# EAGLE schematic Yale spring 2019 FRIDAY (EAGLE 9.4.0)
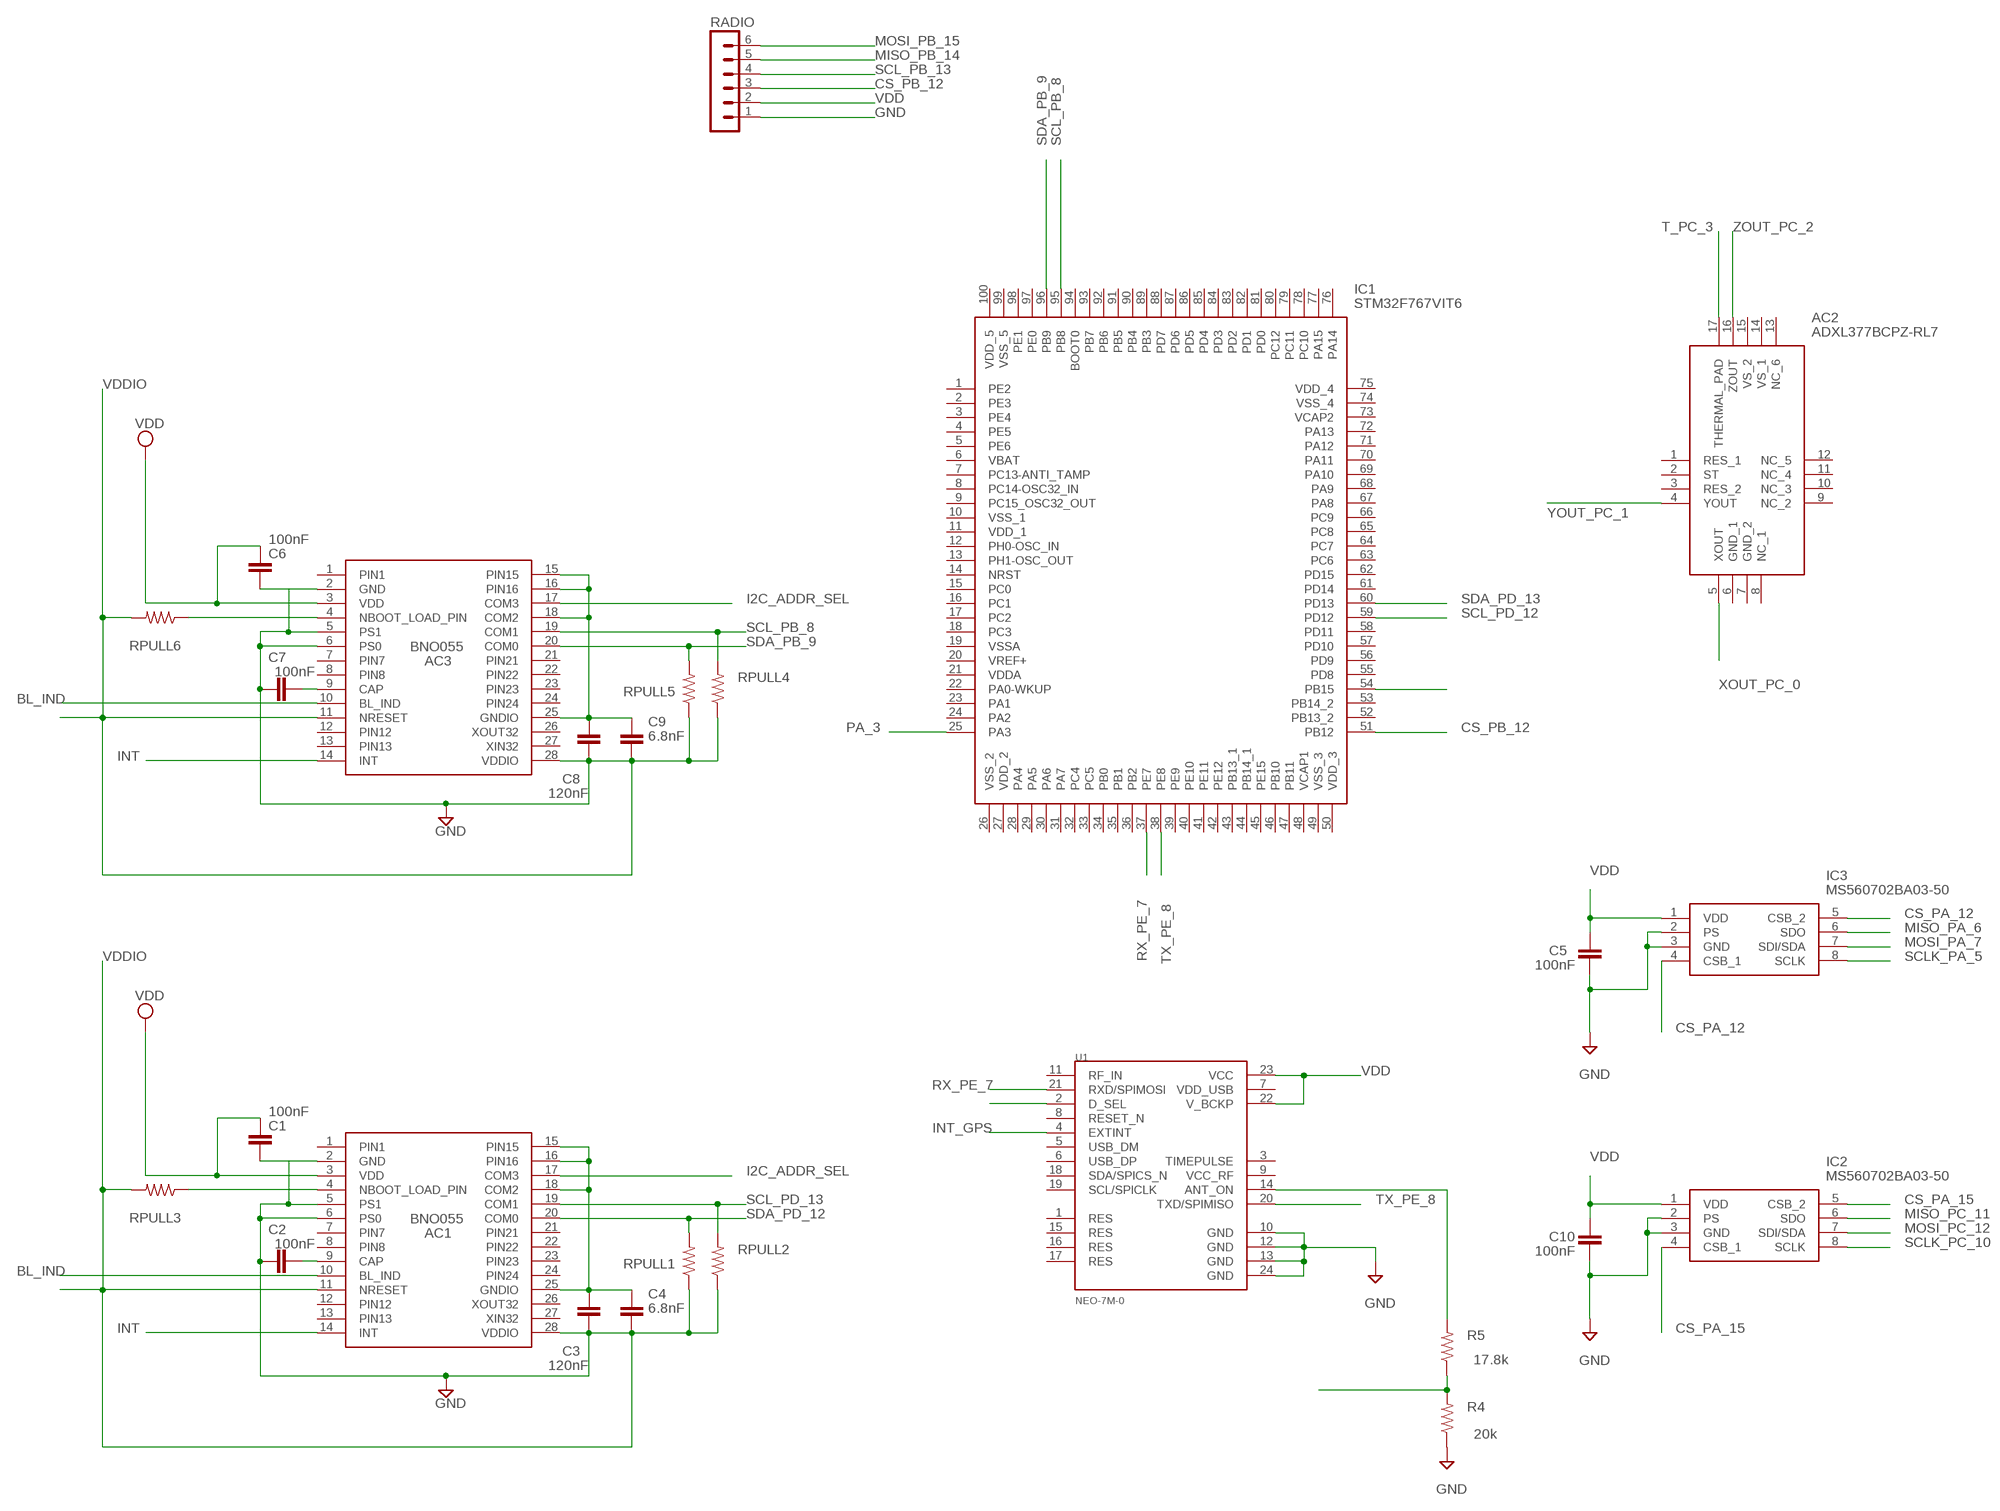
[diagram p0: schematic, sheet 1]

## Parts
AC1  BNO055  [BNO055]
AC2  ADXL377BCPZ-RL7  [QFN50P300X300X150-17N]
AC3  BNO055  [BNO055]
C1  100nF  C2,5-3  [C2.5-3]
C2  100nF  C2,5-3  [C2.5-3]
C3  120nF  C2,5-3  [C2.5-3]
C4  6.8nF  C2,5-3  [C2.5-3]
C5  100nF  C2,5-3  [C2.5-3]
C6  100nF  C2,5-3  [C2.5-3]
C7  100nF  C2,5-3  [C2.5-3]
C8  120nF  C2,5-3  [C2.5-3]
C9  6.8nF  C2,5-3  [C2.5-3]
C10  100nF  C2,5-3  [C2.5-3]
IC1  STM32F767VIT6  [QFP50P1600X1600X160-100N]
IC2  MS560702BA03-50  [MS5607-02BA03]
IC3  MS560702BA03-50  [MS5607-02BA03]
R4  20k  R-US_R0603  [R0603]
R5  17.8k  R-US_R0603  [R0603]
RADIO  MA06-1  [MA06-1]
RPULL1  R-US_R0603  [R0603]
RPULL2  R-US_R0603  [R0603]
RPULL3  R-US_R0603  [R0603]
RPULL4  R-US_R0603  [R0603]
RPULL5  R-US_R0603  [R0603]
RPULL6  R-US_R0603  [R0603]
U1  NEO-7M-0  [XCVR_NEO-7M-0]

## Nets
BL_IND: AC1.10(BL_IND) AC3.10(BL_IND)
CS_PA_12: IC3.4(CSB_1) IC3.5(CSB_2)
CS_PA_15: IC2.4(CSB_1) IC2.5(CSB_2)
CS_PB_12: IC1.51(PB12) RADIO.3
GND: C5.1 C10.1 IC2.2(PS) IC2.3(GND) IC3.2(PS) IC3.3(GND) R4.1 RADIO.1 U1.10(GND) U1.12(GND) U1.13(GND) U1.24(GND)
I2C_ADDR_SEL: AC1.17(COM3) AC3.17(COM3)
INT: AC1.14(INT) AC3.14(INT)
INT_GPS: U1.4(EXTINT)
MISO_PA_6: IC3.6(SDO)
MISO_PB_14: RADIO.5
MISO_PC_11: IC2.6(SDO)
MOSI_PA_7: IC3.7(SDI/SDA)
MOSI_PB_15: RADIO.6
MOSI_PC_12: IC2.7(SDI/SDA)
N$1: AC1.4(NBOOT_LOAD_PIN) RPULL3.1
N$2: AC1.15(PIN15) AC1.16(PIN16) AC1.18(COM2) AC1.25(GNDIO) C3.2 C4.2
N$3: AC3.9(CAP) C7.2
N$4: AC1.9(CAP) C2.2
N$5: AC3.15(PIN15) AC3.16(PIN16) AC3.18(COM2) AC3.25(GNDIO) C8.2 C9.2
N$6: AC3.4(NBOOT_LOAD_PIN) RPULL6.1
N$7: IC1.54(PB15)
N$9: U1.2(D_SEL)
N$10: R5.2 U1.14(ANT_ON)
N$11: R4.2 R5.1
PA_3: IC1.25(PA3)
RX_PE_7: IC1.37(PE7) U1.21(RXD/SPIMOSI)
SCL_PB_8: AC3.19(COM1) IC1.95(PB8) RPULL4.2
SCL_PB_13: RADIO.4
SCL_PD_12: IC1.59(PD12)
SCL_PD_13: AC1.19(COM1) RPULL2.2
SCLK_PA_5: IC3.8(SCLK)
SCLK_PC_10: IC2.8(SCLK)
SDA_PB_9: AC3.20(COM0) IC1.96(PB9) RPULL5.2
SDA_PD_12: AC1.20(COM0) RPULL1.2
SDA_PD_13: IC1.60(PD13)
T_PC_3: AC2.17(THERMAL_PAD)
TX_PE_8: IC1.38(PE8) U1.20(TXD/SPIMISO)
VDD: AC1.3(VDD) AC3.3(VDD) C1.1 C5.2 C6.1 C10.2 IC2.1(VDD) IC3.1(VDD) RADIO.2 U1.22(V_BCKP) U1.23(VCC)
VDDIO: AC1.2(GND) AC1.5(PS1) AC1.6(PS0) AC1.11(NRESET) AC1.28(VDDIO) AC3.2(GND) AC3.5(PS1) AC3.6(PS0) AC3.11(NRESET) AC3.28(VDDIO) C1.2 C2.1 C3.1 C4.1 C6.2 C7.1 C8.1 C9.1 RPULL1.1 RPULL2.1 RPULL3.2 RPULL4.1 RPULL5.1 RPULL6.2 ; supply symbol labelled GND
XOUT_PC_0: AC2.5(XOUT)
YOUT_PC_1: AC2.4(YOUT)
ZOUT_PC_2: AC2.16(ZOUT)
Unconnected: AC1.1(PIN1) AC1.7(PIN7) AC1.8(PIN8) AC1.12(PIN12) AC1.13(PIN13) AC1.21(PIN21) AC1.22(PIN22) AC1.23(PIN23) AC1.24(PIN24) AC1.26(XOUT32) AC1.27(XIN32) AC2.1(RES_1) AC2.2(ST) AC2.3(RES_2) AC2.6(GND_1) AC2.7(GND_2) AC2.8(NC_1) AC2.9(NC_2) AC2.10(NC_3) AC2.11(NC_4) AC2.12(NC_5) AC2.13(NC_6) AC2.14(VS_1) AC2.15(VS_2) AC3.1(PIN1) AC3.7(PIN7) AC3.8(PIN8) AC3.12(PIN12) AC3.13(PIN13) AC3.21(PIN21) AC3.22(PIN22) AC3.23(PIN23) AC3.24(PIN24) AC3.26(XOUT32) AC3.27(XIN32) IC1.1(PE2) IC1.2(PE3) IC1.3(PE4) IC1.4(PE5) IC1.5(PE6) IC1.6(VBAT) IC1.7(PC13-ANTI_TAMP) IC1.8(PC14-OSC32_IN) IC1.9(PC15_OSC32_OUT) IC1.10(VSS_1) IC1.11(VDD_1) IC1.12(PH0-OSC_IN) IC1.13(PH1-OSC_OUT) IC1.14(NRST) IC1.15(PC0) IC1.16(PC1) IC1.17(PC2) IC1.18(PC3) IC1.19(VSSA) IC1.20(VREF+) IC1.21(VDDA) IC1.22(PA0-WKUP) IC1.23(PA1) IC1.24(PA2) IC1.26(VSS_2) IC1.27(VDD_2) IC1.28(PA4) IC1.29(PA5) IC1.30(PA6) IC1.31(PA7) IC1.32(PC4) IC1.33(PC5) IC1.34(PB0) IC1.35(PB1) IC1.36(PB2) IC1.39(PE9) IC1.40(PE10) IC1.41(PE11) IC1.42(PE12) IC1.43(PB13_1) IC1.44(PB14_1) IC1.45(PE15) IC1.46(PB10) IC1.47(PB11) IC1.48(VCAP1) IC1.49(VSS_3) IC1.50(VDD_3) IC1.52(PB13_2) IC1.53(PB14_2) IC1.55(PD8) IC1.56(PD9) IC1.57(PD10) IC1.58(PD11) IC1.61(PD14) IC1.62(PD15) IC1.63(PC6) IC1.64(PC7) IC1.65(PC8) IC1.66(PC9) IC1.67(PA8) IC1.68(PA9) IC1.69(PA10) IC1.70(PA11) IC1.71(PA12) IC1.72(PA13) IC1.73(VCAP2) IC1.74(VSS_4) IC1.75(VDD_4) IC1.76(PA14) IC1.77(PA15) IC1.78(PC10) IC1.79(PC11) IC1.80(PC12) IC1.81(PD0) IC1.82(PD1) IC1.83(PD2) IC1.84(PD3) IC1.85(PD4) IC1.86(PD5) IC1.87(PD6) IC1.88(PD7) IC1.89(PB3) IC1.90(PB4) IC1.91(PB5) IC1.92(PB6) IC1.93(PB7) IC1.94(BOOT0) IC1.97(PE0) IC1.98(PE1) IC1.99(VSS_5) IC1.100(VDD_5) U1.1(RES) U1.3(TIMEPULSE) U1.5(USB_DM) U1.6(USB_DP) U1.8(RESET_N) U1.9(VCC_RF) U1.11(RF_IN) U1.15(RES) U1.16(RES) U1.17(RES) U1.18(SDA/SPICS_N) U1.19(SCL/SPICLK)

## Power pins joined to a net without a drawn wire
VDD_USB: U1.7(VDD_USB)

## Library data of the parts
AC1 AC3 = BNO055:BNO055: IMUs - Inertial Measurement Units Absolute Orientation 9-Axis Sensor Source: Datasheet <https://eu.mouser.com/datasheet/2/783/BST_BNO055_DS000_14-1221282.pdf>; DESCRIPTION: IMUs - Inertial Measurement Units Absolute Orientation 9-Axis Sensor; HEIGHT: 1.18mm; MANUFACTURER_NAME: Bosch; MANUFACTURER_PART_NUMBER: BNO055; MOUSER_PART_NUMBER: 262-BNO055
AC2 = ADXL377BCPZ-RL7:ADXL377BCPZ-RL7: Accelerometers 3-Axis High g Analog MEMS Source: Datasheet <http://www.mouser.com/datasheet/2/609/ADXL377-1503899.pdf>; DESCRIPTION: Accelerometers 3-Axis High g Analog MEMS; HEIGHT: 1.5mm; MANUFACTURER_NAME: Analog Devices; MANUFACTURER_PART_NUMBER: ADXL377BCPZ-RL7; MOUSER_PART_NUMBER: 584-ADXL377BCPZ-R7; MOUSER_PRICE-STOCK: https://www.mouser.com/Search/Refine.aspx?Keyword=584-ADXL377BCPZ-R7
C1-C10 = capacitor-wima:C: CAPACITOR naming: grid - package width
IC1 = STM32F767VIT6:STM32F767VIT6: STMicroelectronics STM32F767VIT6, 32bit ARM Cortex M7 Microcontroller, 216MHz, 2048 kB Flash, 100-Pin LQFP Source: Datasheet <https://componentsearchengine.com/Datasheets/1/STM32F767VIT6.pdf>; DESCRIPTION: STMicroelectronics STM32F767VIT6, 32bit ARM Cortex M7 Microcontroller, 216MHz, 2048 kB Flash, 100-Pin LQFP; HEIGHT: 1.6mm; MANUFACTURER_NAME: STMicroelectronics; MANUFACTURER_PART_NUMBER: STM32F767VIT6; MOUSER_PART_NUMBER: 511-STM32F767VIT6; MOUSER_PRICE-STOCK: https://www.mouser.com/Search/Refine.aspx?Keyword=511-STM32F767VIT6
IC2 IC3 = MS560702BA03-50:MS560702BA03-50: MS560702BA03-50, Barometric Pressure Sensor, 1200mbar 0 3.6 V Output, 8-Pin QFN Source: Datasheet <https://componentsearchengine.com/Datasheets/1/MS560702BA03-50.pdf>; DESCRIPTION: MS560702BA03-50, Barometric Pressure Sensor, 1200mbar 0 3.6 V Output, 8-Pin QFN; HEIGHT: mm; MANUFACTURER_NAME: TE Connectivity; MANUFACTURER_PART_NUMBER: MS560702BA03-50; MOUSER_PART_NUMBER: 824-MS560702BA03-50; MOUSER_PRICE-STOCK: https://www.mouser.com/Search/Refine.aspx?Keyword=824-MS560702BA03-50
R4 R5 RPULL1-RPULL6 = rcl:R-US_: RESISTOR, American symbol; SPICEPREFIX: R
RADIO = con-lstb:MA06-1: PIN HEADER; OC_FARNELL: unknown; OC_NEWARK: unknown
U1 = NEO-7M-0:NEO-7M-0; DESCRIPTION: u-blox 7 GPS/GNSS Module*Crystal*ROM*12x16mm; DIGI-KEY_PART_NUMBER: 672-1170-1-ND; DIGI-KEY_PURCHASE_URL: https://www.digikey.com/product-detail/en/u-blox-america-inc/NEO-7M-0/672-1170-1-ND/9818047?utm_source=snapeda&utm_medium=aggregator&utm_campaign=symbol; MF: u-blox; MP: NEO-7M-0; PACKAGE: SMD-24 u-blox